# EAGLE design preparedinstruments_0_bechemel_v10 # KEYPAD (EAGLE 9.6.2)

## Sheet 1 of 2
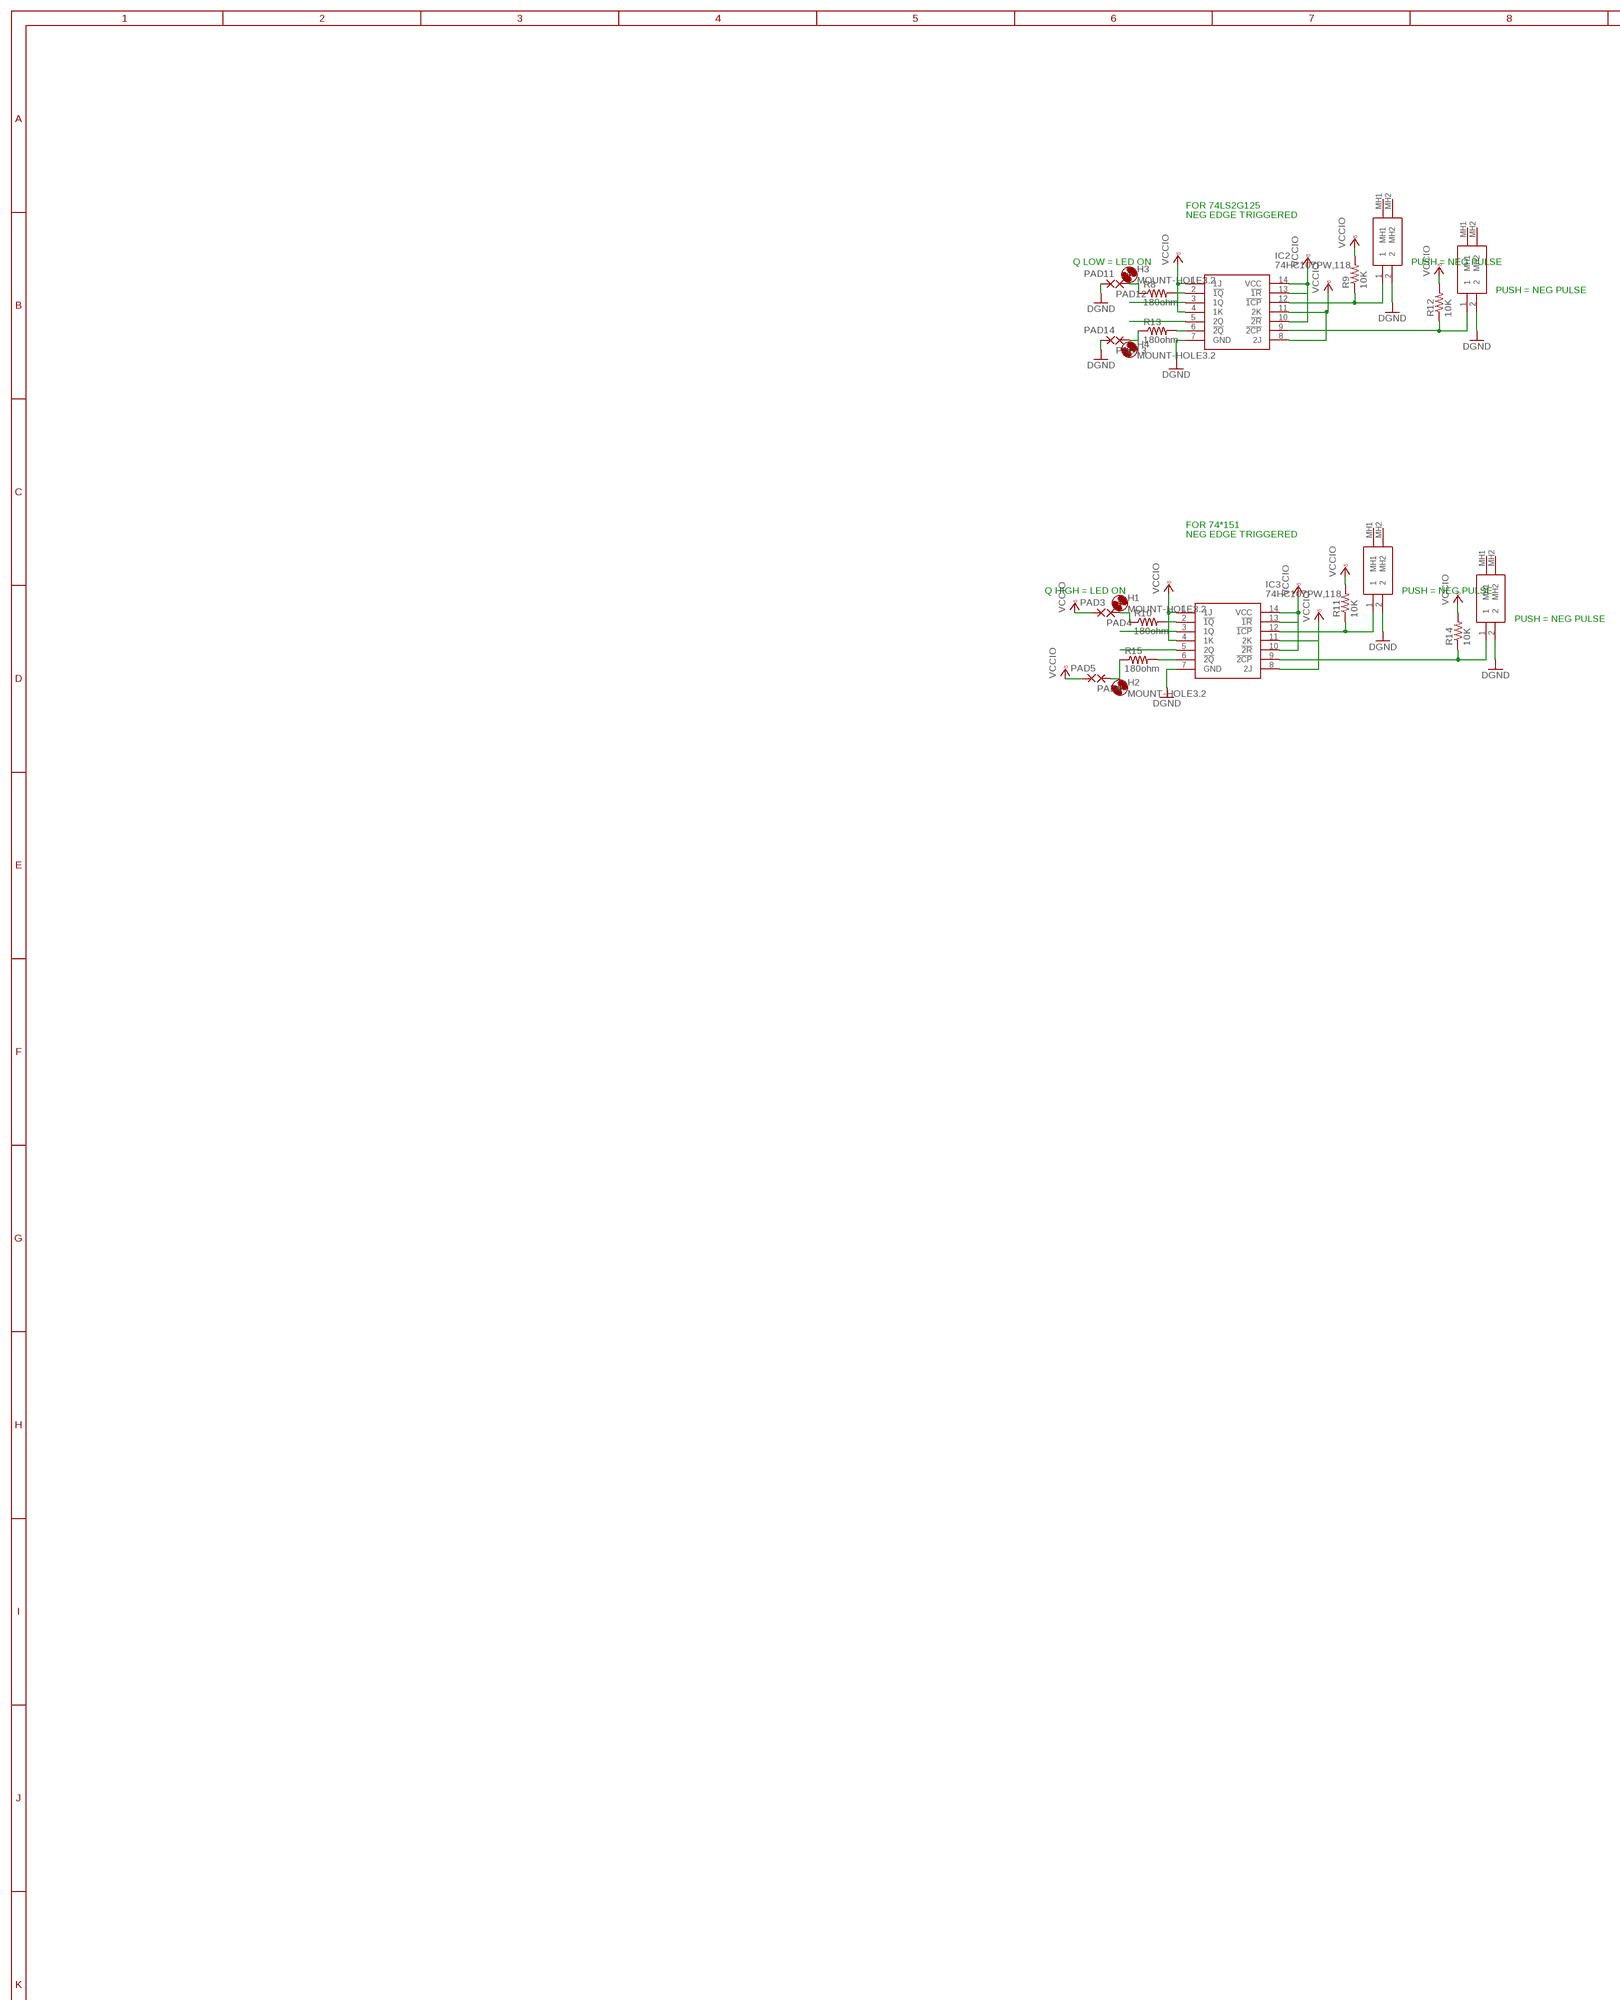
[diagram p0: schematic, sheet 1, part 1 of 3]
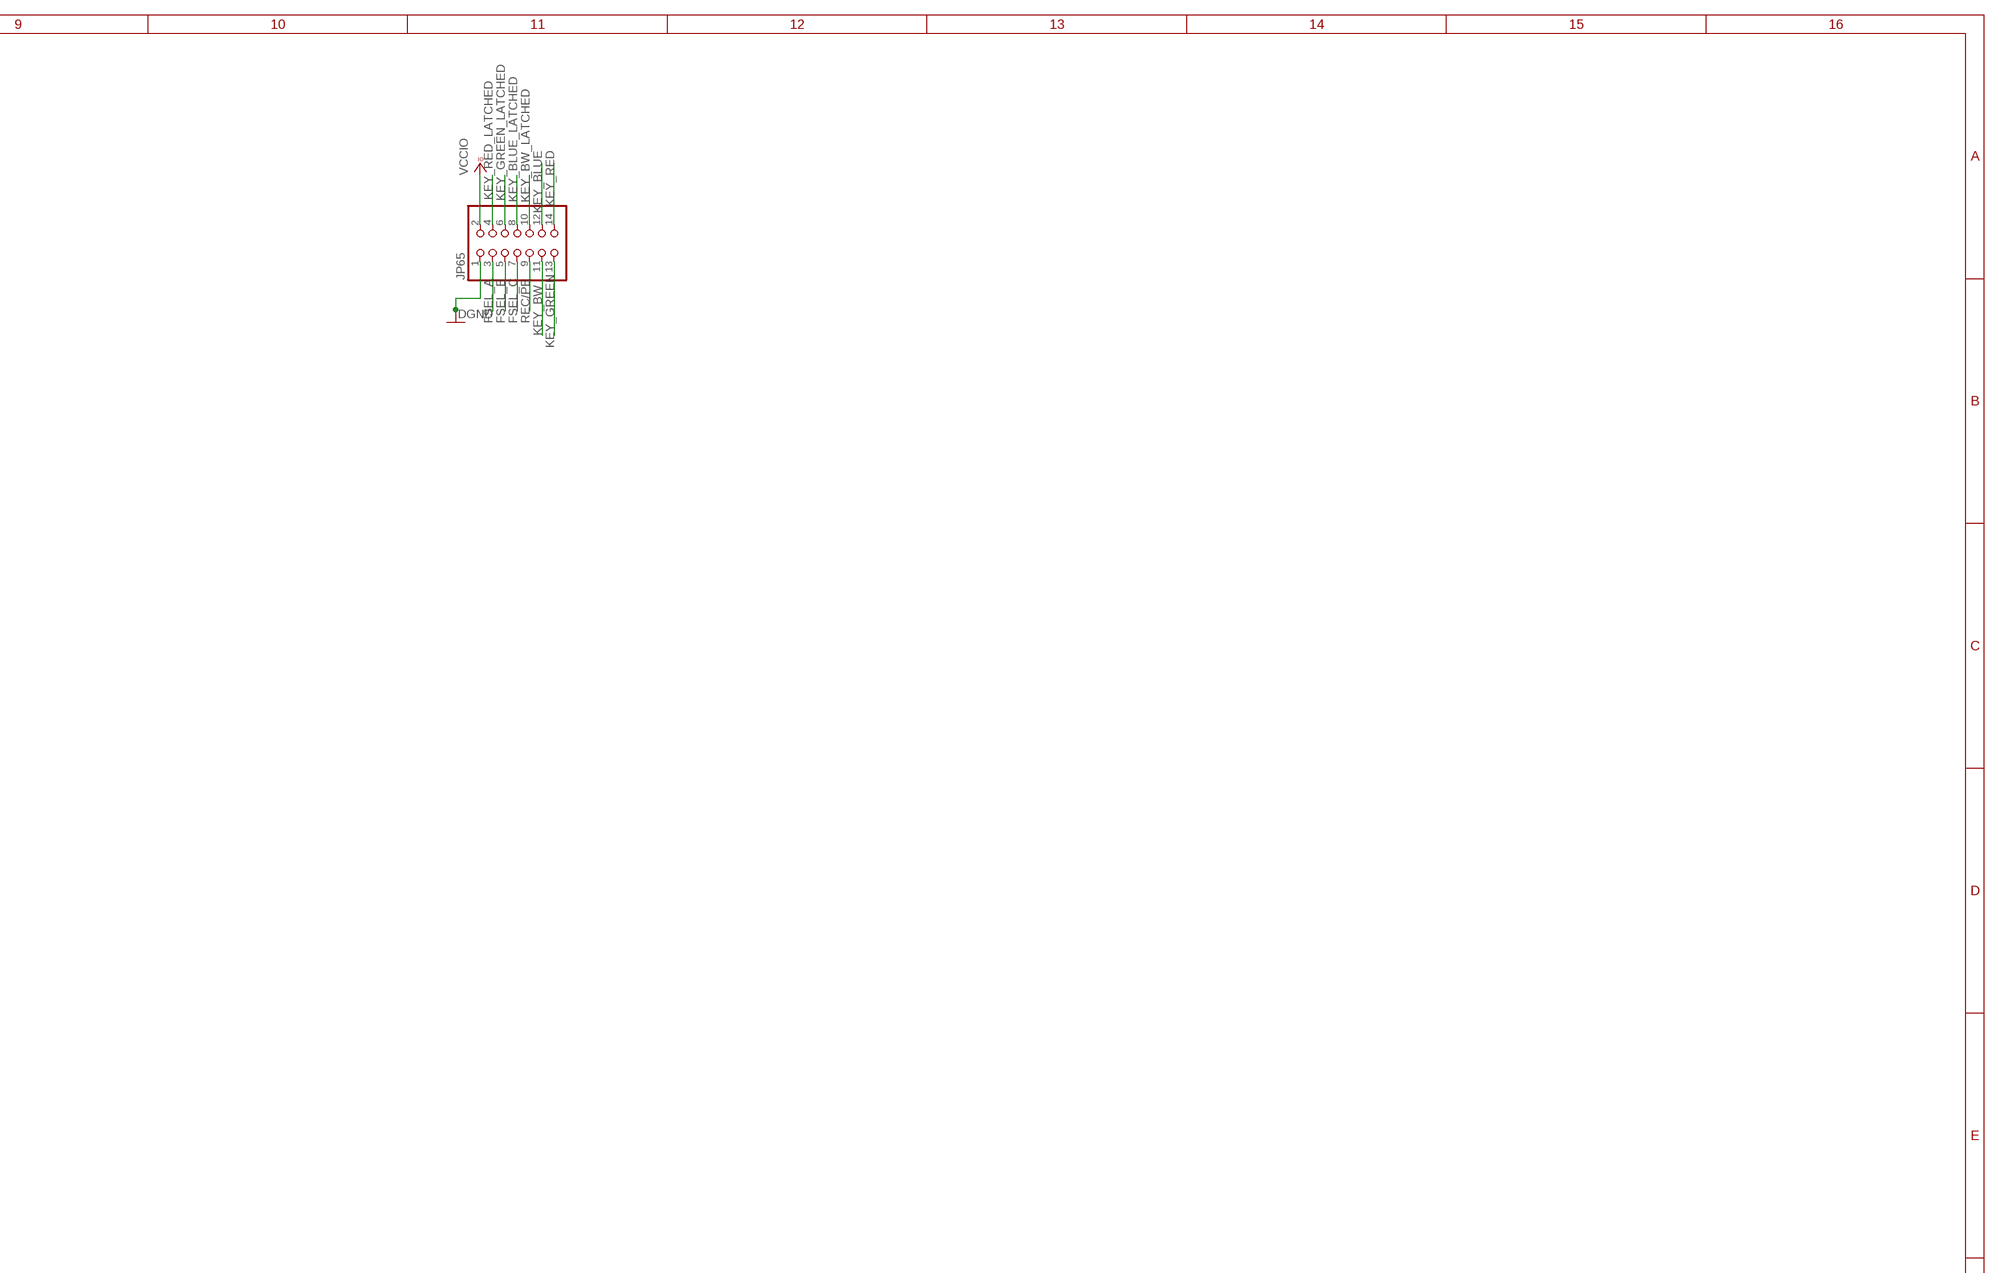
[diagram p1: schematic, sheet 1, part 2 of 3]
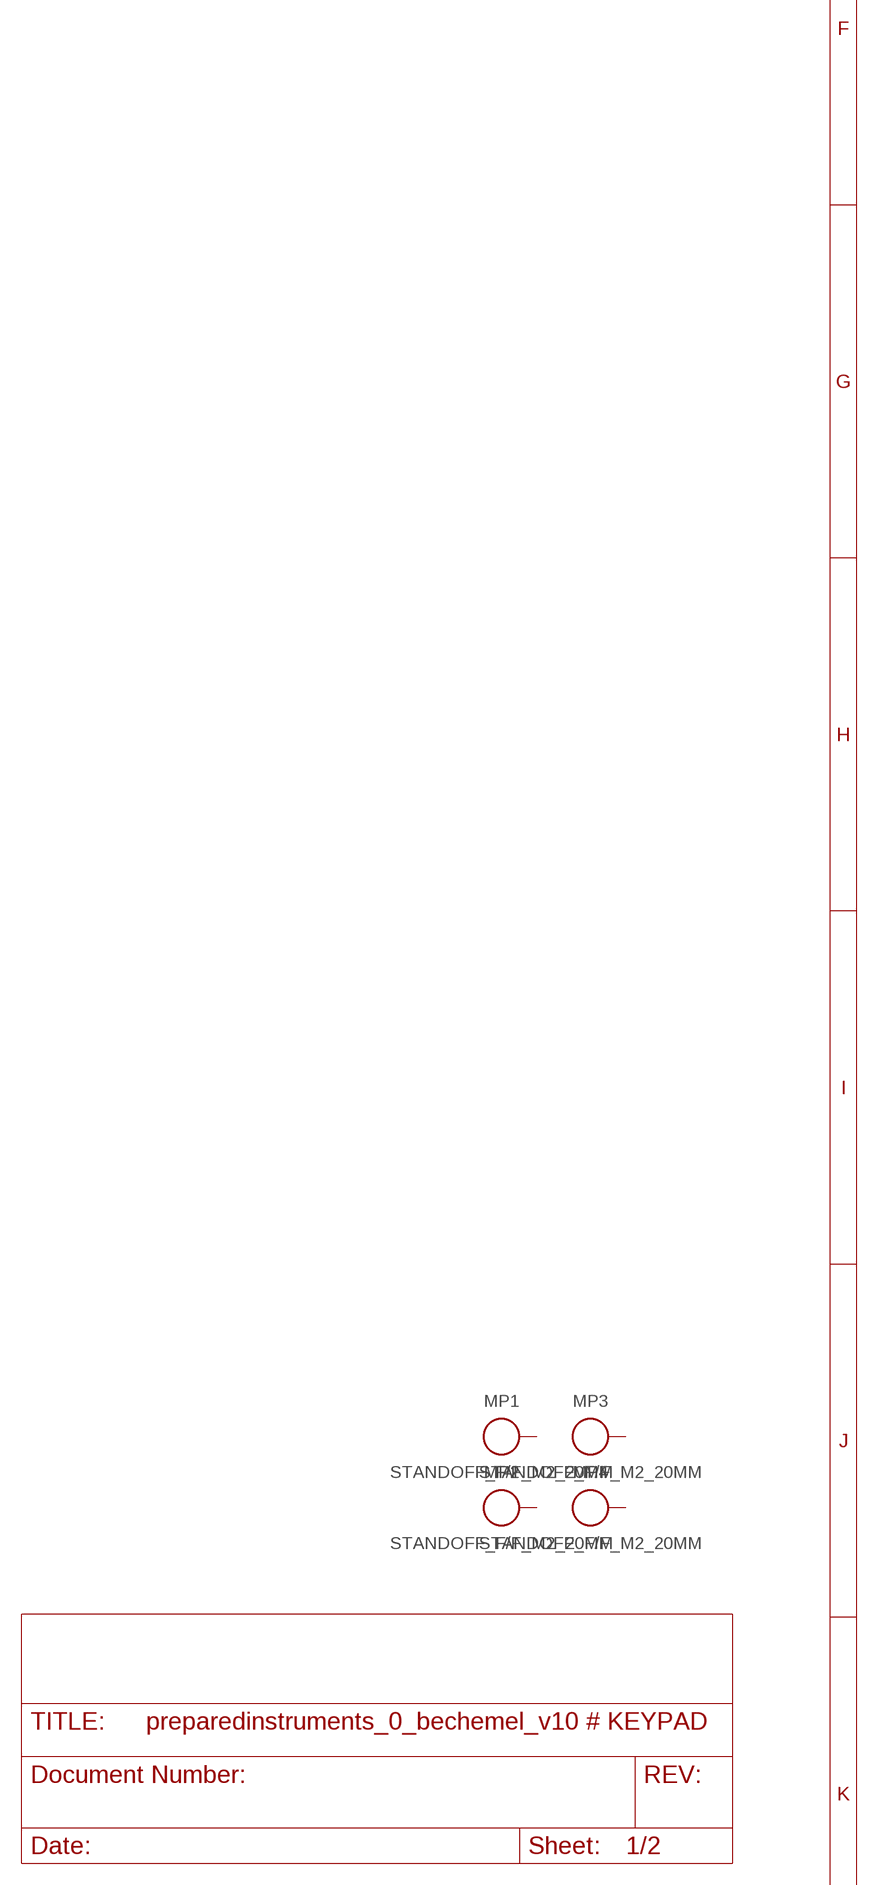
[diagram p2: schematic, sheet 1, part 3 of 3]

### Parts
H1  MOUNT-HOLE3.2  [3,2]
H2  MOUNT-HOLE3.2  [3,2]
H3  MOUNT-HOLE3.2  [3,2]
H4  MOUNT-HOLE3.2  [3,2]
IC2  74HC107PW,118  [SOP65P640X110-14N]
IC3  74HC107PW,118  [SOP65P640X110-14N]
JP65  PINHD-2X7  [2X07]
MP1  STANDOFF_F/F_M2_20MM  [STANDOFF_HEX_FEMALE_400X2000_M2X0.4_MTGP600H220]
MP2  STANDOFF_F/F_M2_20MM  [STANDOFF_HEX_FEMALE_400X2000_M2X0.4_MTGP600H220]
MP3  STANDOFF_F/F_M2_20MM  [STANDOFF_HEX_FEMALE_400X2000_M2X0.4_MTGP600H220]
MP4  STANDOFF_F/F_M2_20MM  [STANDOFF_HEX_FEMALE_400X2000_M2X0.4_MTGP600H220]
PAD3  SMD2  [SMD1,27-2,54]
PAD4  SMD2  [SMD1,27-2,54]
PAD5  SMD2  [SMD1,27-2,54]
PAD6  SMD2  [SMD1,27-2,54]
PAD11  SMD2  [SMD1,27-2,54]
PAD12  SMD2  [SMD1,27-2,54]
PAD13  SMD2  [SMD1,27-2,54]
PAD14  SMD2  [SMD1,27-2,54]
R8  180ohm  R-US_R0805  [R0805]
R9  10K  R-US_R0805  [R0805]
R10  180ohm  R-US_R0805  [R0805]
R11  10K  R-US_R0805  [R0805]
R12  10K  R-US_R0805  [R0805]
R13  180ohm  R-US_R0805  [R0805]
R14  10K  R-US_R0805  [R0805]
R15  180ohm  R-US_R0805  [R0805]
S6  MX1A-11NW  [MX1A11NW]
S7  MX1A-11NW  [MX1A11NW]
S8  MX1A-11NW  [MX1A11NW]
S9  MX1A-11NW  [MX1A11NW]

### Nets
DGND: IC2.7(GND) IC3.7(GND) JP65.1 PAD11.1(P) PAD14.1(P) S6.2 S7.2 S8.2 S9.2 ; also sheet 2
FSEL_A: JP65.3
FSEL_B: JP65.5
FSEL_C: JP65.7
KEY_BLUE: JP65.12
KEY_BLUE_LATCHED: JP65.8
KEY_BW: JP65.11
KEY_BW_LATCHED: JP65.10
KEY_GREEN: JP65.13
KEY_GREEN_LATCHED: JP65.6
KEY_RED: JP65.14
KEY_RED_LATCHED: JP65.4
N$13: PAD12.1(P) R8.1
N$14: IC2.2(!1Q) R8.2
N$15: IC2.3(1Q)
N$16: IC2.12(!1CP) R9.1 S6.1
N$17: PAD4.1(P) R10.1
N$18: IC3.2(!1Q) R10.2
N$19: IC3.3(1Q)
N$20: IC3.12(!1CP) R11.1 S7.1
N$21: IC2.9(!2CP) R12.1 S8.1
N$22: PAD13.1(P) R13.1
N$23: IC2.6(!2Q) R13.2
N$24: IC2.5(2Q)
N$25: IC3.9(!2CP) R14.1 S9.1
N$26: PAD6.1(P) R15.1
N$27: IC3.6(!2Q) R15.2
N$28: IC3.5(2Q)
REC/PB: JP65.9
VCCIO: IC2.1(1J) IC2.4(1K) IC2.8(2J) IC2.10(!2R) IC2.11(2K) IC2.13(!1R) IC2.14(VCC) IC3.1(1J) IC3.4(1K) IC3.8(2J) IC3.10(!2R) IC3.11(2K) IC3.13(!1R) IC3.14(VCC) JP65.2 PAD3.1(P) PAD5.1(P) R9.2 R11.2 R12.2 R14.2 ; also sheet 2
Unconnected: MP1.1 MP2.1 MP3.1 MP4.1 S6.MH1 S6.MH2 S7.MH1 S7.MH2 S8.MH1 S8.MH2 S9.MH1 S9.MH2

### Notes on the sheet
- FOR 74LS2G125
- NEG EDGE TRIGGERED
- Q LOW = LED ON | PUSH = NEG PULSE
- PUSH = NEG PULSE
- FOR 74*151
- NEG EDGE TRIGGERED
- Q HIGH = LED ON | PUSH = NEG PULSE
- PUSH = NEG PULSE

## Sheet 2 of 2
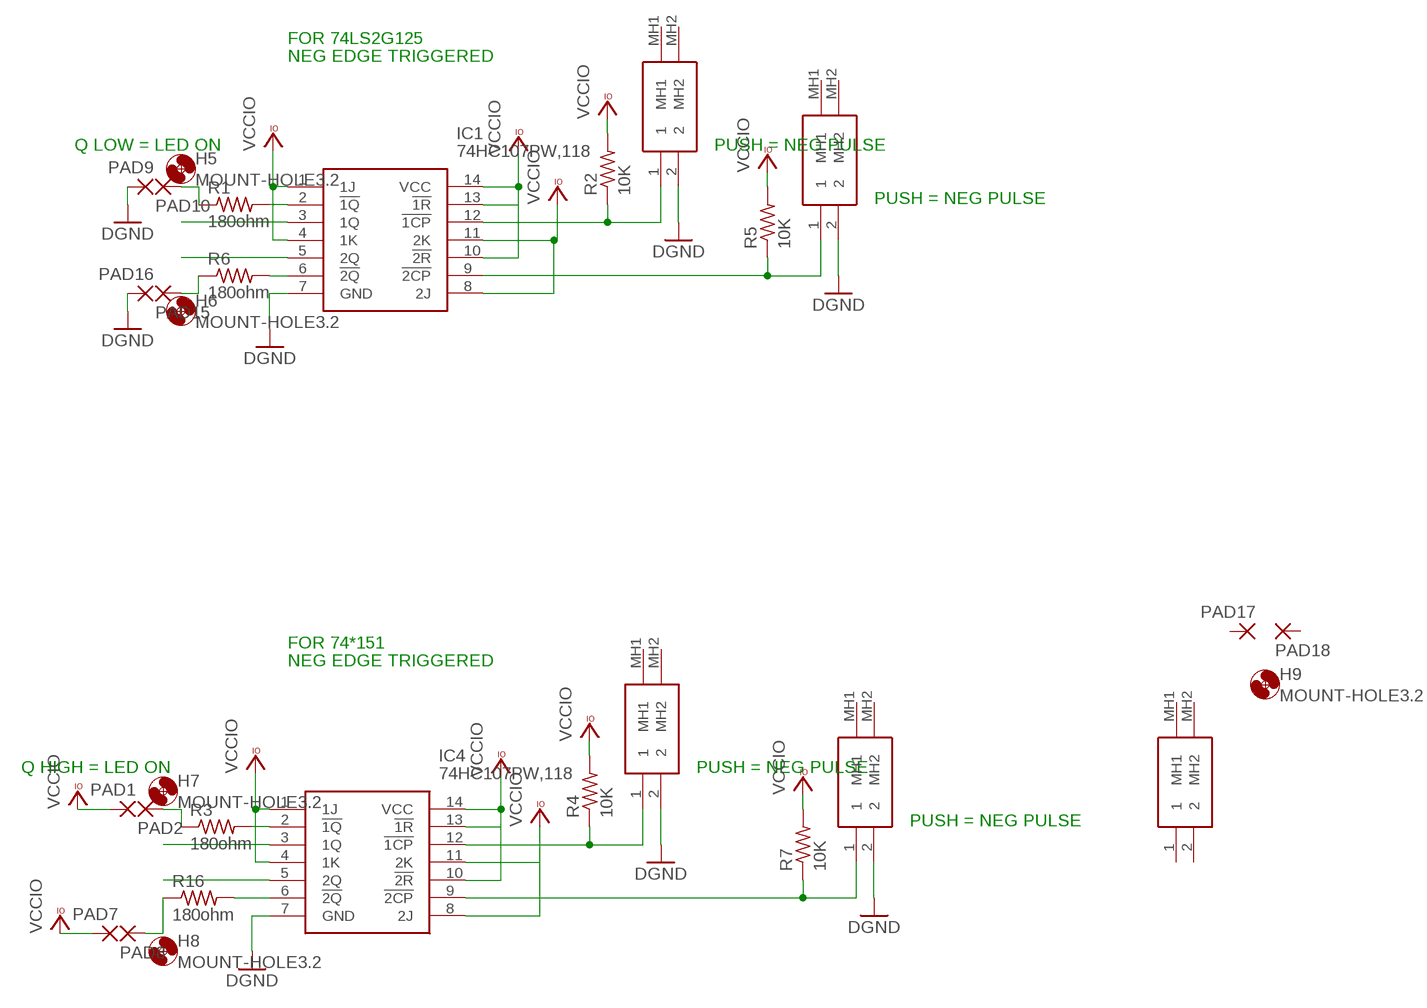
[diagram p3: schematic, sheet 2]

### Parts
H5  MOUNT-HOLE3.2  [3,2]
H6  MOUNT-HOLE3.2  [3,2]
H7  MOUNT-HOLE3.2  [3,2]
H8  MOUNT-HOLE3.2  [3,2]
H9  MOUNT-HOLE3.2  [3,2]
IC1  74HC107PW,118  [SOP65P640X110-14N]
IC4  74HC107PW,118  [SOP65P640X110-14N]
PAD1  SMD2  [SMD1,27-2,54]
PAD2  SMD2  [SMD1,27-2,54]
PAD7  SMD2  [SMD1,27-2,54]
PAD8  SMD2  [SMD1,27-2,54]
PAD9  SMD2  [SMD1,27-2,54]
PAD10  SMD2  [SMD1,27-2,54]
PAD15  SMD2  [SMD1,27-2,54]
PAD16  SMD2  [SMD1,27-2,54]
PAD17  SMD2  [SMD1,27-2,54]
PAD18  SMD2  [SMD1,27-2,54]
R1  180ohm  R-US_R0805  [R0805]
R2  10K  R-US_R0805  [R0805]
R3  180ohm  R-US_R0805  [R0805]
R4  10K  R-US_R0805  [R0805]
R5  10K  R-US_R0805  [R0805]
R6  180ohm  R-US_R0805  [R0805]
R7  10K  R-US_R0805  [R0805]
R16  180ohm  R-US_R0805  [R0805]
S1  MX1A-11NW  [MX1A11NW]
S2  MX1A-11NW  [MX1A11NW]
S3  MX1A-11NW  [MX1A11NW]
S4  MX1A-11NW  [MX1A11NW]
S5  MX1A-11NW  [MX1A11NW]

### Nets
DGND: IC1.7(GND) IC4.7(GND) PAD9.1(P) PAD16.1(P) S1.2 S2.2 S3.2 S4.2 ; also sheet 1
N$1: PAD10.1(P) R1.1
N$2: IC1.2(!1Q) R1.2
N$3: IC1.3(1Q)
N$4: IC1.12(!1CP) R2.1 S1.1
N$5: PAD2.1(P) R3.1
N$6: IC4.2(!1Q) R3.2
N$7: IC4.3(1Q)
N$8: IC4.12(!1CP) R4.1 S2.1
N$9: IC1.9(!2CP) R5.1 S3.1
N$10: PAD15.1(P) R6.1
N$11: IC1.6(!2Q) R6.2
N$12: IC1.5(2Q)
N$29: IC4.9(!2CP) R7.1 S4.1
N$30: PAD8.1(P) R16.1
N$31: IC4.6(!2Q) R16.2
N$32: IC4.5(2Q)
VCCIO: IC1.1(1J) IC1.4(1K) IC1.8(2J) IC1.10(!2R) IC1.11(2K) IC1.13(!1R) IC1.14(VCC) IC4.1(1J) IC4.4(1K) IC4.8(2J) IC4.10(!2R) IC4.11(2K) IC4.13(!1R) IC4.14(VCC) PAD1.1(P) PAD7.1(P) R2.2 R4.2 R5.2 R7.2 ; also sheet 1
Unconnected: PAD17.1(P) PAD18.1(P) S1.MH1 S1.MH2 S2.MH1 S2.MH2 S3.MH1 S3.MH2 S4.MH1 S4.MH2 S5.1 S5.2 S5.MH1 S5.MH2

### Notes on the sheet
- FOR 74LS2G125
- NEG EDGE TRIGGERED
- Q LOW = LED ON | PUSH = NEG PULSE
- PUSH = NEG PULSE
- FOR 74*151
- NEG EDGE TRIGGERED
- Q HIGH = LED ON | PUSH = NEG PULSE
- PUSH = NEG PULSE

## Library data of the parts
H1-H9 = holes:MOUNT-HOLE: MOUNTING HOLE with drill center marker
IC1-IC4 = 74HC107PW_118:74HC107PW,118: 74HC(T)107 - Dual JK flip-flop with reset; negative-edge trigger@en-us Source: Datasheet <https://assets.nexperia.com/documents/data-sheet/74HC_HCT107.pdf>; DESCRIPTION: 74HC(T)107 - Dual JK flip-flop with reset; negative-edge trigger@en-us; HEIGHT: 1.1mm; MANUFACTURER_NAME: Nexperia; MANUFACTURER_PART_NUMBER: 74HC107PW,118; MOUSER_PART_NUMBER: 771-HC107PW118; MOUSER_PRICE-STOCK: https://www.mouser.co.uk/ProductDetail/Nexperia/74HC107PW118?qs=P62ublwmbi8k2l1WkAc68Q%3D%3D
JP65 = pinhead:PINHD-2X7: PIN HEADER
MP1-MP4 = PCB-Fasteners_Hardware:STANDOFF_F/F: Female-Female Standoff/Spacer with Mounting pad and hole. Essentra : Female Standoff <https://www.essentracomponents.co.in/index.php?option=com_virtuemart&view=productdetails&virtuemart_product_id=14493> The hole and pad sizes may vary based on the application and type of hardware; always verify the Manufacturer specification or Global Standards.; CATEGORY: Standoff/Spacer; SUB-CATEGORY: Female-Female
PAD1-PAD18 = wirepad:SMD2: SMD PAD
R1-R16 = adafruit:R-US_: RESISTOR, American symbol
S1-S9 = MX1A-11NW:MX1A-11NW: CHERRY - MX1A-11NW - Tactile Switch, MX Series, Top Actuated, Surface Mount, Plunger for Cap, 59.5 gf, 10mA at 12VDC Source: Datasheet <https://media.digikey.com/pdf/Data Sheets/Cherry PDFs/MX Series.pdf>; DESCRIPTION: CHERRY - MX1A-11NW - Tactile Switch, MX Series, Top Actuated, Surface Mount, Plunger for Cap, 59.5 gf, 10mA at 12VDC; HEIGHT: 15.2mm; MANUFACTURER_NAME: Cherry; MANUFACTURER_PART_NUMBER: MX1A-11NW; MOUSER_PART_NUMBER: 540-MX1A-11NW; MOUSER_PRICE-STOCK: https://www.mouser.co.uk/ProductDetail/CHERRY/MX1A-11NW?qs=5iusCjFLgR7487Rvpe7dvw%3D%3D

## Board
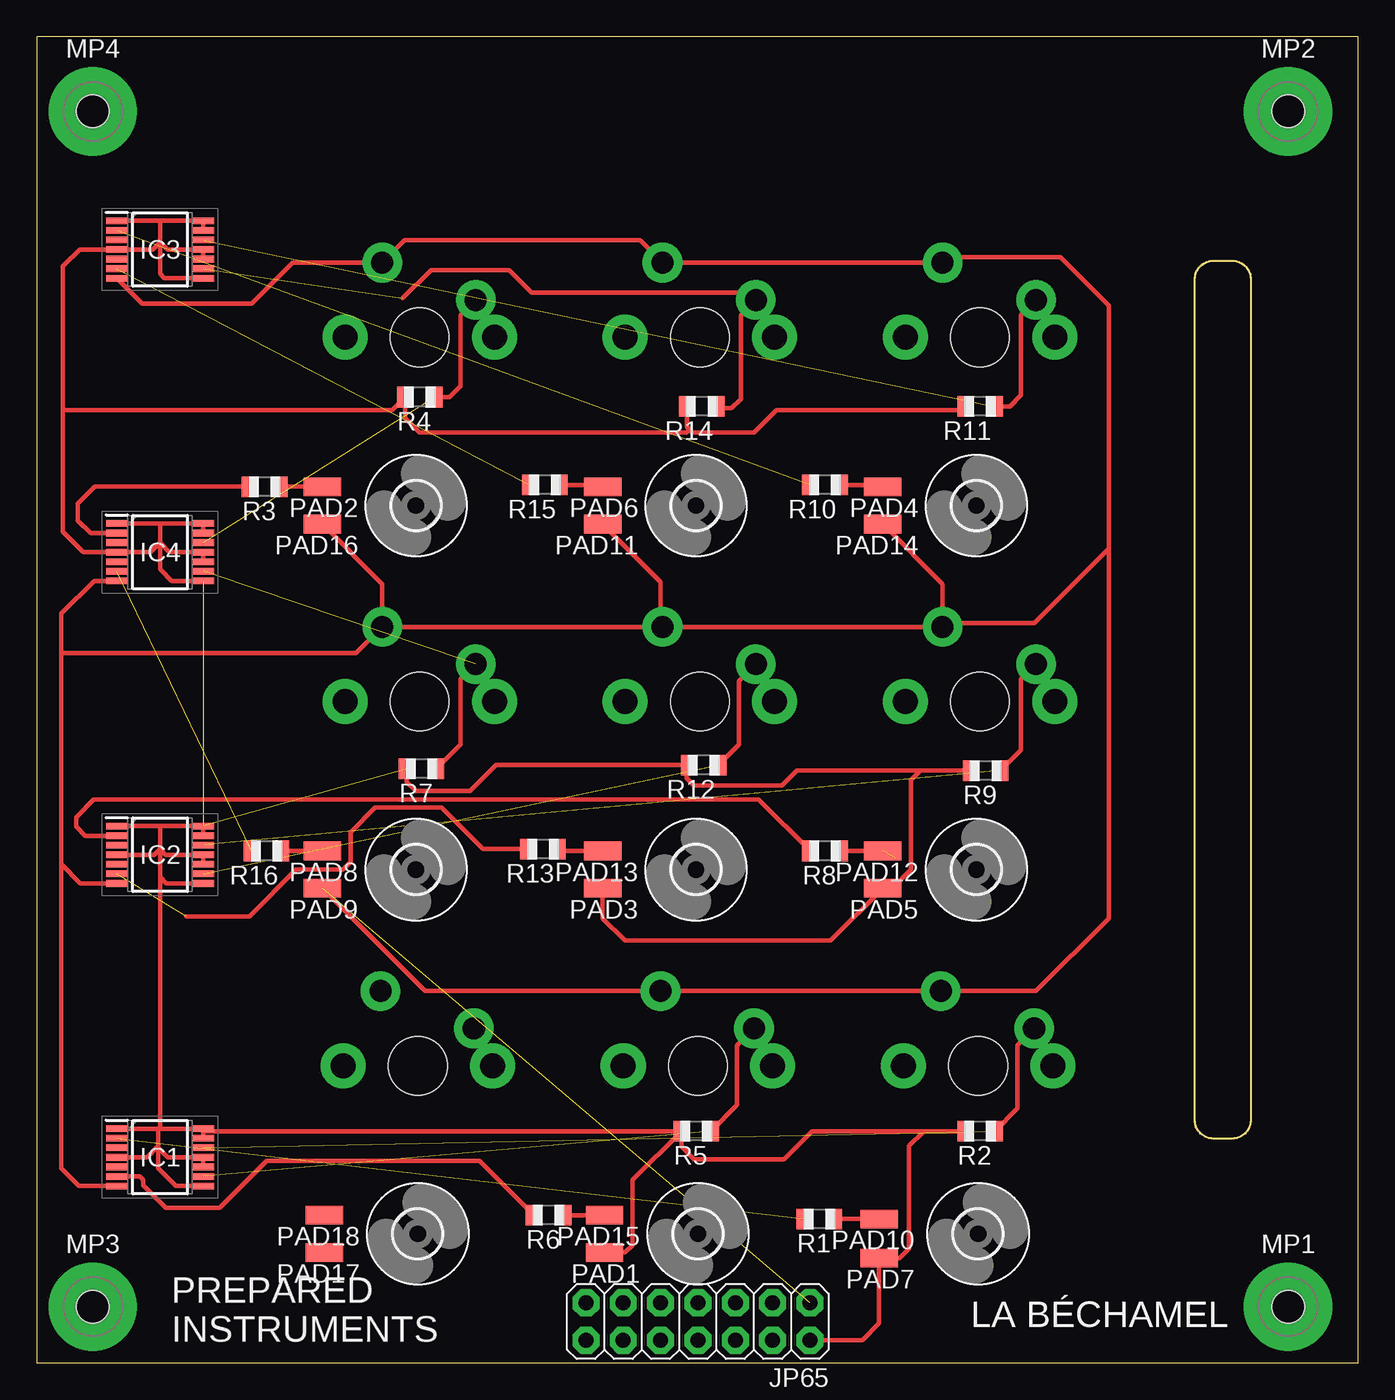
[diagram p4: board, top side]
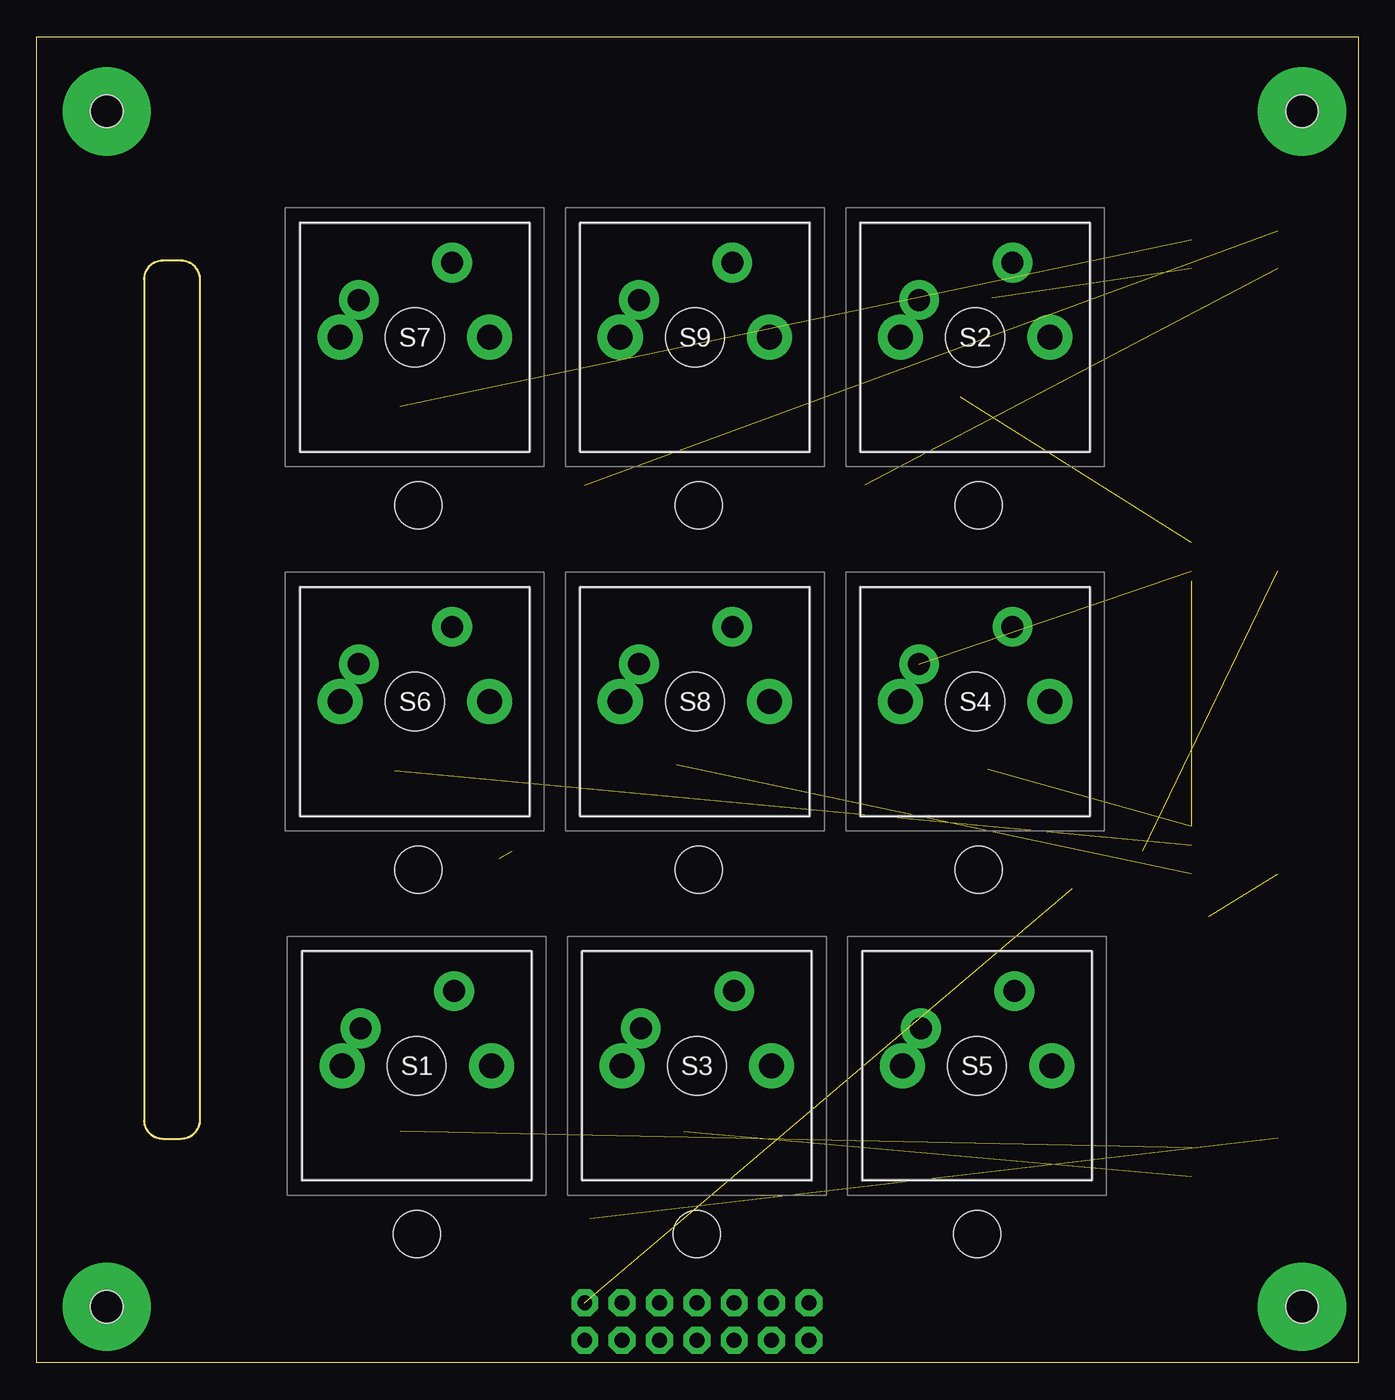
[diagram p5: board, bottom side, seen from below]

Size 89.84 x 90.16 mm. Coordinates in mm from the lower left corner, seen from the top.
Outline: 0,0 89.84,0 89.84,90.16 0,90.16 0,0
Outline: 82.55,73.66 82.55,16.51 arc-90 81.28,15.24 80.01,15.24 arc-90 78.74,16.51 78.74,73.66 arc-90 80.01,74.93 81.28,74.93 arc-90 82.55,73.66
Copper layers (1*16): Top 0.035mm / dielectric 1.6mm / Bottom 0.035mm
Design rules "jlcpcb-2layers": minimum track width 5mil, minimum drill 0.3mm, track to track 5mil, track to pad 5mil, pad to pad 5mil, via to via 5mil, smd to smd 5mil, copper to edge 0.2mm, drill to drill 6mil, minimum pad ring 10mil, minimum via ring 3mil, stop-mask expansion 4mil, vias tented up to drill 0mil, thermal gap 10mil

### Footprints (pad centres in the part's own frame; a part is rotated, then mirrored left to right if it is on the bottom)
3,2 = hole 3.2: 0,0
SOP65P640X110-14N = smd 1.475 x 0.45: 1 -2.938,1.95; 2 -2.938,1.3; 3 -2.938,0.65; 4 -2.938,0; 5 -2.938,-0.65; 6 -2.938,-1.3; 7 -2.938,-1.95; 8 2.938,-1.95; 9 2.938,-1.3; 10 2.938,-0.65; 11 2.938,0; 12 2.938,0.65; 13 2.938,1.3; 14 2.938,1.95
2X07 = drill 1.016 octagon: 1 -7.62,-1.27; 2 -7.62,1.27; 3 -5.08,-1.27; 4 -5.08,1.27; 5 -2.54,-1.27; 6 -2.54,1.27; 7 0,-1.27; 8 0,1.27; 9 2.54,-1.27; 10 2.54,1.27; 11 5.08,-1.27; 12 5.08,1.27; 13 7.62,-1.27; 14 7.62,1.27
STANDOFF_HEX_FEMALE_400X2000_M2X0.4_MTGP600H220 = drill 2.2 pad 6: 1 0,0 | hole 2.2: 0,0
SMD1,27-2,54 = smd 1.27 x 2.54: 1 0,0
R0805 = smd 1.1 x 1.4: 1 -1,0; 2 1,0
MX1A11NW = drill 1.499 pad 2.248: 1 0,0; 2 6.35,2.54 | drill 1.702 pad 2.553: MH1 -1.27,-2.54; MH2 8.89,-2.54 | hole 3.988: 3.81,-2.54

### Placement (x,y rotation side)
H1  63.88,33.53 0 top
H2  44.83,33.53 0 top
H3  44.83,58.29 0 top
H4  63.88,58.29 0 top
H5  25.78,33.53 0 top
H6  25.78,58.29 0 top
H7  64.01,8.76 0 top
H8  44.96,8.76 0 top
H9  25.91,8.76 0 top
IC1  8.38,13.97 0 top
IC2  8.38,34.54 0 top
IC3  8.38,75.69 0 top
IC4  8.38,55.12 0 top
JP65  44.96,2.79 180 top
MP1  85.09,3.81 0 top
MP2  85.09,85.09 0 top
MP3  3.81,3.81 0 top
MP4  3.81,85.09 0 top
PAD1  38.61,7.49 90 top
PAD2  19.43,59.56 90 top
PAD3  38.48,32.26 90 top
PAD4  57.53,59.56 90 top
PAD5  57.53,32.26 90 top
PAD6  38.48,59.56 90 top
PAD7  57.28,7.11 90 top
PAD8  19.43,34.8 90 top
PAD9  19.43,32.26 90 top
PAD10  57.28,9.78 90 top
PAD11  38.48,57.02 90 top
PAD12  57.53,34.8 90 top
PAD13  38.48,34.8 90 top
PAD14  57.53,57.02 90 top
PAD15  38.61,10.03 90 top
PAD16  19.43,57.02 90 top
PAD17  19.56,7.49 90 top
PAD18  19.56,10.03 90 top
R1  53.21,9.78 180 top
R2  64.14,15.75 180 top
R3  15.49,59.56 180 top
R4  26.04,65.66 180 top
R5  44.83,15.75 180 top
R6  34.8,10.03 180 top
R7  26.16,40.39 180 top
R8  53.59,34.8 180 top
R9  64.52,40.26 180 top
R10  53.59,59.69 180 top
R11  64.14,65.02 180 top
R12  45.34,40.64 180 top
R13  34.42,34.92 180 top
R14  45.21,65.02 180 top
R15  34.54,59.69 180 top
R16  15.62,34.8 180 top
S1  67.82,22.73 0 bottom
S2  29.84,72.26 0 bottom
S3  48.77,22.73 0 bottom
S4  29.84,47.5 0 bottom
S5  29.72,22.73 0 bottom
S6  67.94,47.5 0 bottom
S7  67.94,72.26 0 bottom
S8  48.9,47.5 0 bottom
S9  48.9,72.26 0 bottom

### Tracks (layer width: path | path; a pad name or v marks a point on that pad's centre or on a via)
DGND  (1 unrouted)
  Top 0.305: S4.2 42.42,50.04 | 42.42,50.04 S8.2 S6.2 61.59,50.29 | PAD16.1 23.5,52.96 S4.2 | PAD11.1 42.42,53.09 42.42,50.04 | PAD14.1 61.59,52.96 61.59,50.29 | 61.59,50.29 67.82,50.29 72.9,55.37 | 72.9,55.37 72.9,71.88 69.6,75.18 61.98,75.18 S7.2 S9.2 41.02,76.33 25.02,76.33 S2.2 17.4,74.8 14.61,72.01 7.18,72.01 IC3.7 | 72.9,55.37 72.9,30.23 67.94,25.27 S1.2 S3.2 26.42,25.27 PAD9.1 | IC2.7 2.97,32.59 1.65,33.91 | 1.65,33.91 1.65,48.26 | 1.65,48.26 1.65,50.93 3.89,53.17 IC4.7 | IC1.7 2.84,12.02 1.65,13.21 1.65,33.91 | S4.2 21.72,48.26 1.65,48.26
N$1
  Top 0.305: R1.1 PAD10.1
N$2  (1 unrouted)
N$4  (1 unrouted)
  Top 0.305: S1.1 66.67,21.59 66.67,17.29 R2.1
N$5
  Top 0.305: PAD2.1 R3.1
N$6
  Top 0.305: R3.2 3.94,59.56 2.79,58.42 2.79,57.28 3.65,56.42 IC4.2
N$8  (1 unrouted)
  Top 0.305: S2.1 28.83,71.25 28.83,66.42 28.07,65.66 R4.1
N$9  (1 unrouted)
  Top 0.305: S3.1 47.62,21.59 47.62,17.54 R5.1
N$10
  Top 0.305: R6.1 PAD15.1
N$11
  Top 0.305: R6.2 30.11,13.72 15.62,13.72 12.45,10.54 8.76,10.54 7.24,12.06 7.24,12.45 7.01,12.67 IC1.6
N$13  (1 unrouted)
  Top 0.305: R8.1 57.91,34.8 58.42,34.29
N$14
  Top 0.305: R8.2 49.09,38.3 3.89,38.3 2.67,37.08 2.67,36.45 3.3,35.81 5.41,35.81 IC2.2
N$16  (1 unrouted)
  Top 0.305: S6.1 66.93,46.48 66.93,41.67 R9.1
N$17
  Top 0.305: R10.1 57.4,59.69 PAD4.1
N$18  (1 unrouted)
N$20  (1 unrouted)
  Top 0.305: S7.1 66.93,71.25 66.93,65.79 66.17,65.02 R11.1
N$21  (1 unrouted)
  Top 0.305: S8.1 47.75,46.35 47.75,42.05 R12.1
N$22
  Top 0.305: R13.1 35.54,34.8 PAD13.1
N$23  (1 unrouted)
  Top 0.305: R13.2 30.35,34.92 27.53,37.74 23.01,37.74 21.34,36.07 21.34,34.04 20.83,33.53 17.65,33.53 14.48,30.35 10.16,30.35
N$25  (1 unrouted)
  Top 0.305: 24.89,72.39 26.8,74.3 32.13,74.3 33.66,72.77 48.39,72.77 S9.1 47.88,71.25 47.88,65.53 47.24,64.9 46.34,64.9 R14.1
N$26
  Top 0.305: R15.1 38.35,59.69 PAD6.1
N$27  (1 unrouted)
N$29  (1 unrouted)
  Top 0.305: S4.1 28.83,46.48 28.83,42.05 R7.1
N$30
  Top 0.305: R16.1 PAD8.1
N$31  (1 unrouted)
VCCIO  (2 unrouted)
  Top 0.305: R11.2 62.88,64.77 50.29,64.77 48.77,63.25 44.58,63.25 44.39,63.44 | 44.39,63.44 44.21,63.61 R14.2 | 44.39,63.44 44.2,63.25 26.04,63.25 25.04,64.25 R4.2 24.15,64.77 1.78,64.77 | PAD3.1 38.48,30.23 40.01,28.7 53.98,28.7 PAD5.1 58.17,32.26 59.44,33.53 59.44,39.62 60.07,40.26 | R2.2 60.33,15.75 | 60.33,15.75 52.7,15.75 50.8,13.84 44.7,13.84 43.83,14.72 R5.2 | R5.2 40.51,12.43 40.51,8 40.01,7.49 PAD1.1 | 60.33,15.75 59.31,14.73 59.31,7.75 58.67,7.11 PAD7.1 57.28,2.67 56.13,1.52 JP65.2 | R7.2 25.16,39.48 25.78,38.86 29.46,38.86 31.24,40.64 44.2,40.64 | R12.2 44.2,40.64 | R9.2 60.07,40.26 | 60.07,40.26 51.69,40.26 50.67,39.24 44.7,39.24 44.2,39.75 44.2,40.64 | IC1.14 8.26,15.92 | IC1.1 8.26,15.92 | IC1.4 7.49,13.97 8.19,14.67 | 8.26,14.73 8.26,15.92 | 8.19,14.67 8.26,14.73 | IC1.13 IC1.14 | IC1.10 IC1.11 8.89,13.97 8.19,14.67 | IC1.8 9.44,12.02 8.26,13.21 8.26,14.73 | IC2.13 IC2.14 8.38,36.49 | IC2.10 IC2.11 8.76,34.54 8.38,34.92 | IC2.1 8.38,36.49 | IC2.8 8.81,32.59 8.38,33.02 | 8.38,33.02 8.38,34.92 | 8.38,34.92 8.38,36.49 | IC2.4 8,34.54 8.38,34.92 | IC4.1 8.38,57.07 | 8.38,57.07 IC4.14 IC4.13 | IC4.10 IC4.11 9.02,55.12 8.38,55.75 | IC4.8 9.19,53.17 8.38,53.98 8.38,55.75 | 8.38,55.75 8.38,57.07 | 8.38,55.75 7.75,55.12 IC4.4 3.17,55.12 1.78,56.52 1.78,64.77 | IC3.1 8.38,77.64 | 8.38,77.64 IC3.14 IC3.13 | IC3.10 IC3.11 8.89,75.69 8.38,76.2 | 8.38,76.2 7.87,75.69 IC3.4 2.92,75.69 1.78,74.55 1.78,64.77 | 8.38,76.2 8.38,77.64 | IC3.8 8.68,73.74 8.38,74.04 8.38,76.2 | 8.26,15.92 8.38,16.05 8.38,33.02 | R5.2 11.49,15.75 IC1.14

### Text on the board
tPlace: LA BÉCHAMEL | PREPARED / INSTRUMENTS